# Altium schematic sheet CAN.SchDoc
size A
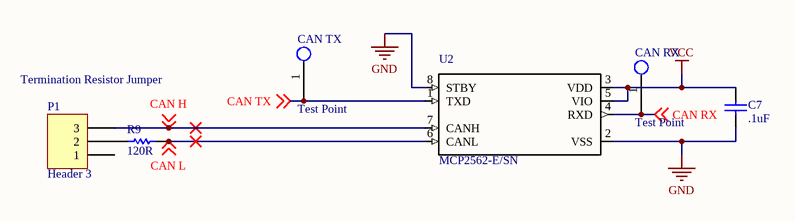
[diagram p0: CAN.SchDoc]

## Parts
C7  .1uF  [CAPC0805(2012)130_N]
CAN_RX  Test Point  [Test Point Through-hole]
CAN_TX  Test Point  [Test Point Through-hole]
P1  Header 3  [HDR1X3]
R9  120R  [RESC0805(2012)_N]
U2  MCP2562-E/SN  [SOIC127P600X175-8N]

## Nets
GND: C7.1 U2.2(VSS) U2.8(STBY)
VCC: C7.2 U2.3(VDD) U2.5(VIO)
CAN H: P1.3 U2.7(CANH) ; off-sheet CAN H
CAN L: R9.2 U2.6(CANL) ; off-sheet CAN L
CAN RX: CAN_RX.1 U2.4(RXD) ; off-sheet CAN RX
CAN TX: CAN_TX.1 U2.1(TXD) ; off-sheet CAN TX
NetP1_2: P1.2 R9.1

Not connected (* = marked no-connect by the designer): P1 1

## Notes on the sheet
- Termination Resistor Jumper

## Library data of the parts
C7 = CMP-1036-02603-1: CAP 390pF 200V ±5% 0805 (2012 Metric) Thickness 1.3mm SMD; Case-Metric: 2012; Case-EIA: 0805; Tolerance: Â±5%; Max Thickness: 1.3 mm; Rated Voltage: 200 V; Technology: SMT; Value: 390pF
P1 = Header 3: Header, 3-Pin; LatestRevisionDate: 17-Jul-2002; LatestRevisionNote: Re-released for DXP Platform.; Publisher: Altium Limited
R9 = 120R 5% 0805: 120R 0.125W 5% 0805 (2012 Metric)  SMD; Case-Metric: 2012; Value: 120.00 Ohm; Case-EIA: 0805; Tolerance: 5 %; Technology: SMT; Power: 0.125 W
U2 = MCP2562-E/SN: Microchip MCP2562-E/SN, CAN Transceiver 1MBps 1-channel IEC 61000-4-2, 8-Pin SOIC; Price: None; MF: Microchip; SnapEDA_Link: https://www.snapeda.com/parts/MCP2562-E/SN/Microchip/view-part/?ref=snap; MP: MCP2562-E/SN; Availability: Unavailable; Package: SO-8 Microchip; Value: *